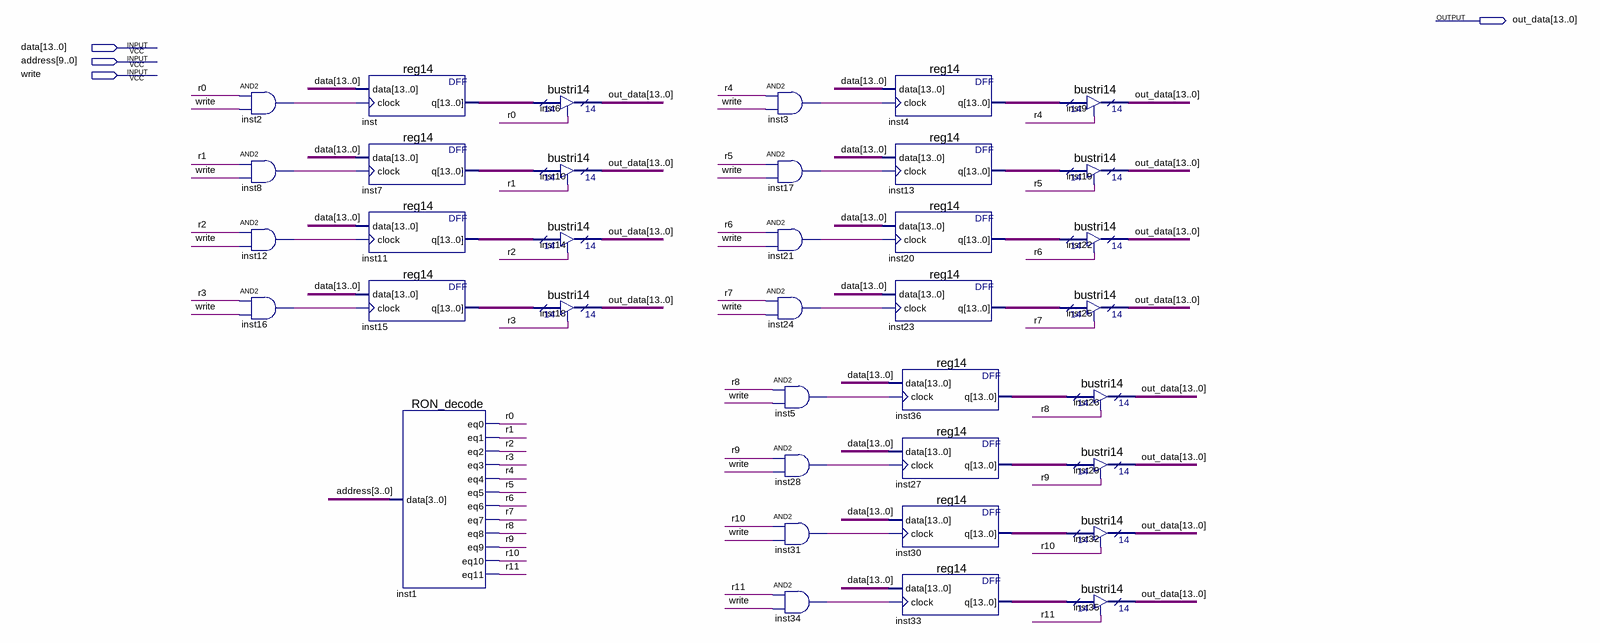
[diagram p0: schematic sheet]
// Quartus schematic RON.bdf as structural Verilog: 37 symbols, 4 pins
module RON (
  input  [13:0] data,
  input  [9:0] address,
  input  write,
  output [13:0] out_data
);

  wire inst2_out, inst3_out, inst5_out, inst8_out, inst12_out, inst16_out, inst17_out, inst21_out,
       inst24_out, inst28_out, inst31_out, inst34_out, r0, r1, r2, r3, r4, r5, r6, r7, r8, r9, r10, r11;
  wire [13:0] inst4_q, inst7_q, inst11_q, inst13_q, inst15_q, inst20_q, inst23_q, inst27_q, inst30_q,
       inst33_q, inst36_q, inst_q;

  and inst2 (inst2_out, r0, write);
  and inst8 (inst8_out, r1, write);
  and inst12 (inst12_out, r2, write);
  and inst16 (inst16_out, r3, write);
  reg14 inst (.data(data), .clock(inst2_out), .q(inst_q));
  reg14 inst7 (.data(data), .clock(inst8_out), .q(inst7_q));
  reg14 inst11 (.data(data), .clock(inst12_out), .q(inst11_q));
  reg14 inst15 (.data(data), .clock(inst16_out), .q(inst15_q));
  RON_decode inst1 (
    .data(address[3:0]), .eq0(r0), .eq1(r1), .eq2(r2), .eq3(r3), .eq4(r4), .eq5(r5), .eq6(r6), .eq7(r7),
    .eq8(r8), .eq9(r9), .eq10(r10), .eq11(r11));
  bustri14 inst6 (.enabledt(r0), .data(inst_q), .tridata(out_data));
  bustri14 inst10 (.enabledt(r1), .data(inst7_q), .tridata(out_data));
  bustri14 inst14 (.enabledt(r2), .data(inst11_q), .tridata(out_data));
  bustri14 inst18 (.enabledt(r3), .data(inst15_q), .tridata(out_data));
  and inst3 (inst3_out, r4, write);
  and inst17 (inst17_out, r5, write);
  and inst21 (inst21_out, r6, write);
  and inst24 (inst24_out, r7, write);
  and inst5 (inst5_out, r8, write);
  and inst28 (inst28_out, r9, write);
  and inst31 (inst31_out, r10, write);
  and inst34 (inst34_out, r11, write);
  reg14 inst4 (.data(data), .clock(inst3_out), .q(inst4_q));
  reg14 inst13 (.data(data), .clock(inst17_out), .q(inst13_q));
  reg14 inst20 (.data(data), .clock(inst21_out), .q(inst20_q));
  reg14 inst23 (.data(data), .clock(inst24_out), .q(inst23_q));
  reg14 inst36 (.data(data), .clock(inst5_out), .q(inst36_q));
  reg14 inst27 (.data(data), .clock(inst28_out), .q(inst27_q));
  reg14 inst30 (.data(data), .clock(inst31_out), .q(inst30_q));
  reg14 inst33 (.data(data), .clock(inst34_out), .q(inst33_q));
  bustri14 inst9 (.enabledt(r4), .data(inst4_q), .tridata(out_data));
  bustri14 inst19 (.enabledt(r5), .data(inst13_q), .tridata(out_data));
  bustri14 inst22 (.enabledt(r6), .data(inst20_q), .tridata(out_data));
  bustri14 inst25 (.enabledt(r7), .data(inst23_q), .tridata(out_data));
  bustri14 inst26 (.enabledt(r8), .data(inst36_q), .tridata(out_data));
  bustri14 inst29 (.enabledt(r9), .data(inst27_q), .tridata(out_data));
  bustri14 inst32 (.enabledt(r10), .data(inst30_q), .tridata(out_data));
  bustri14 inst35 (.enabledt(r11), .data(inst33_q), .tridata(out_data));
endmodule
